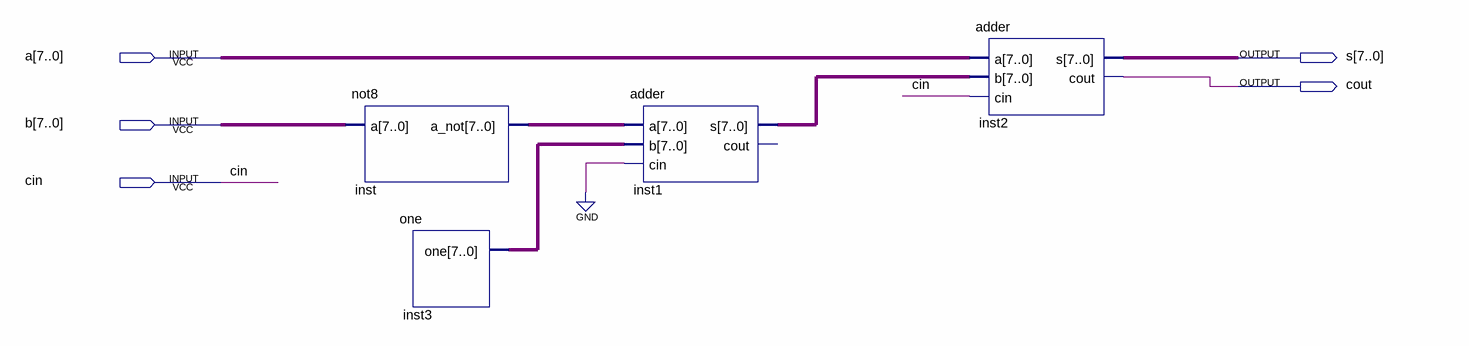
[diagram p0: schematic sheet]
// Quartus schematic sub.bdf as structural Verilog: 4 symbols, 5 pins
module sub (
  input  [7:0] a,
  input  [7:0] b,
  input  cin,
  output [7:0] s,
  output cout
);

  wire [7:0] inst1_s, inst3_one, inst_a_not;

  not8 inst (.a(b), .a_not(inst_a_not));
  one inst3 (.one(inst3_one));
  adder inst1 (.a(inst_a_not), .b(inst3_one), .cin(1'b0), .s(inst1_s));  // open: cout
  adder inst2 (.a(a), .b(inst1_s), .cin(cin), .s(s), .cout(cout));
endmodule
